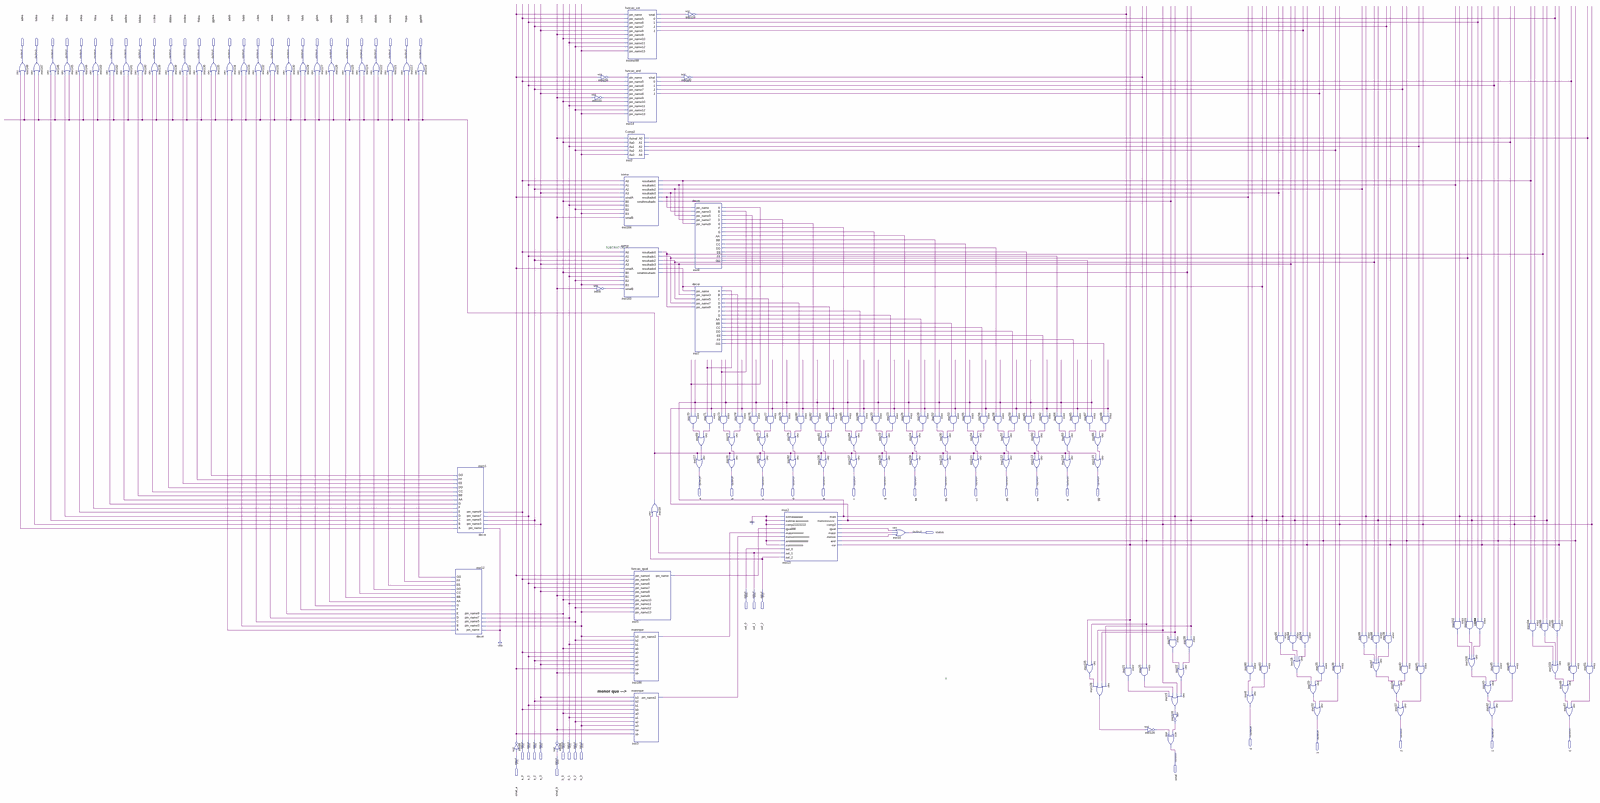
[diagram p0: schematic sheet, whole]
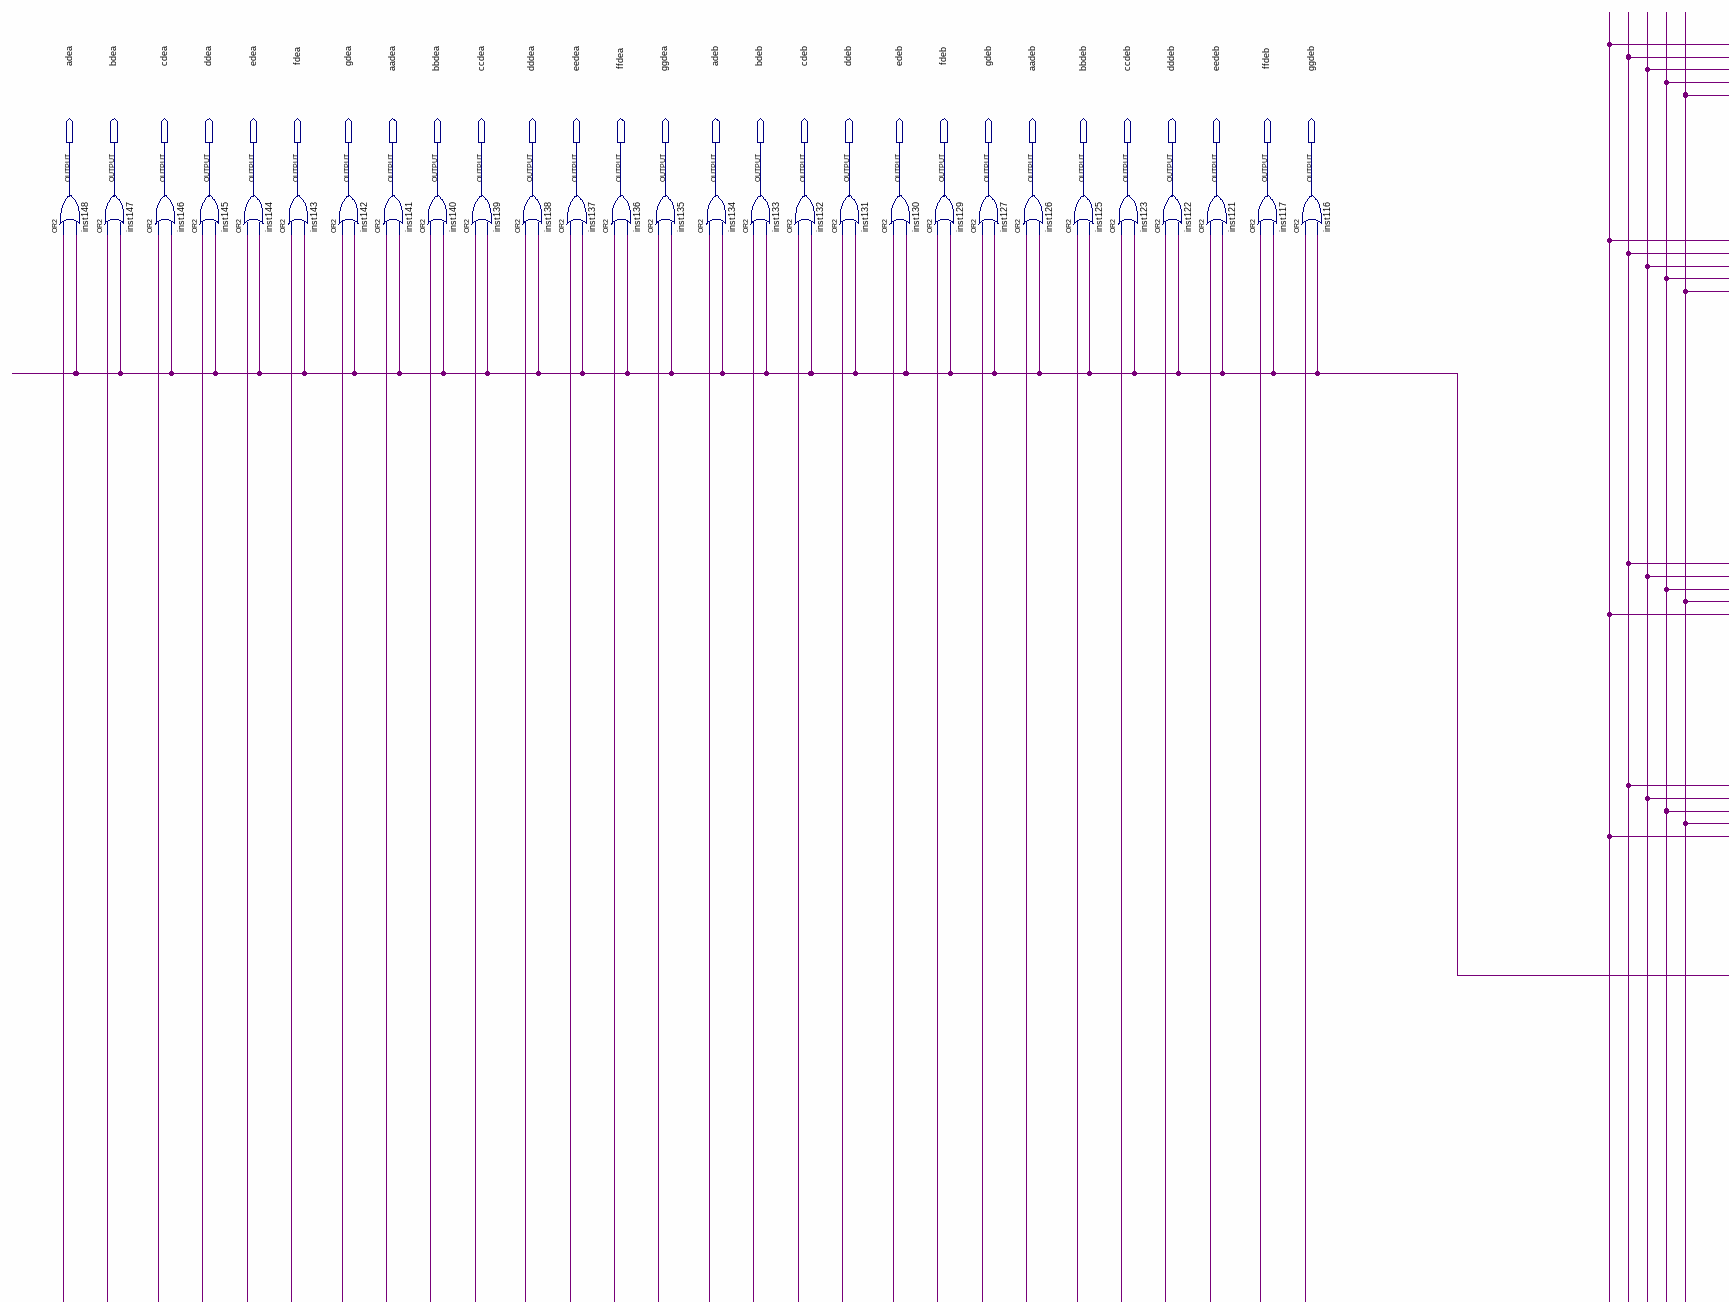
[diagram p1: schematic sheet, upper left part]
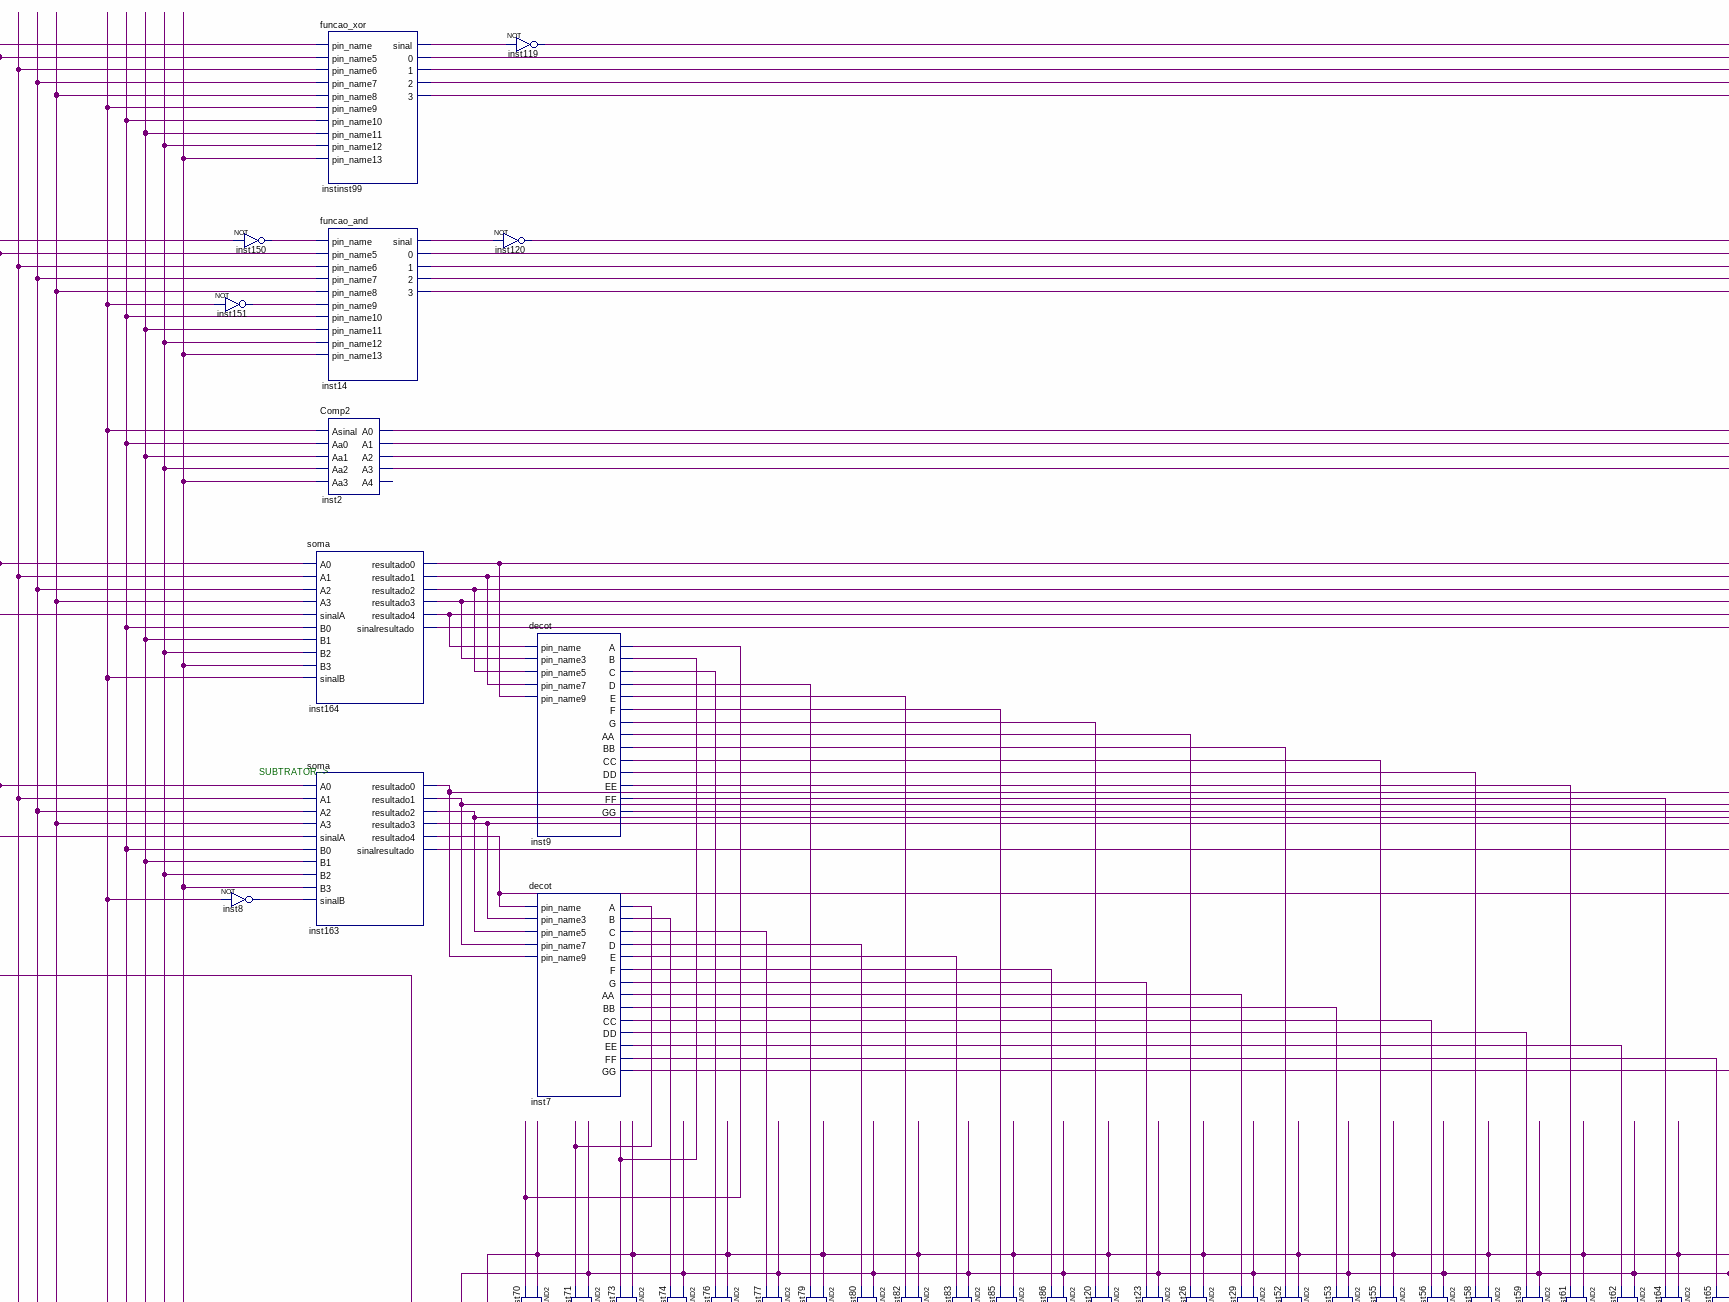
[diagram p2: schematic sheet, upper centre part]
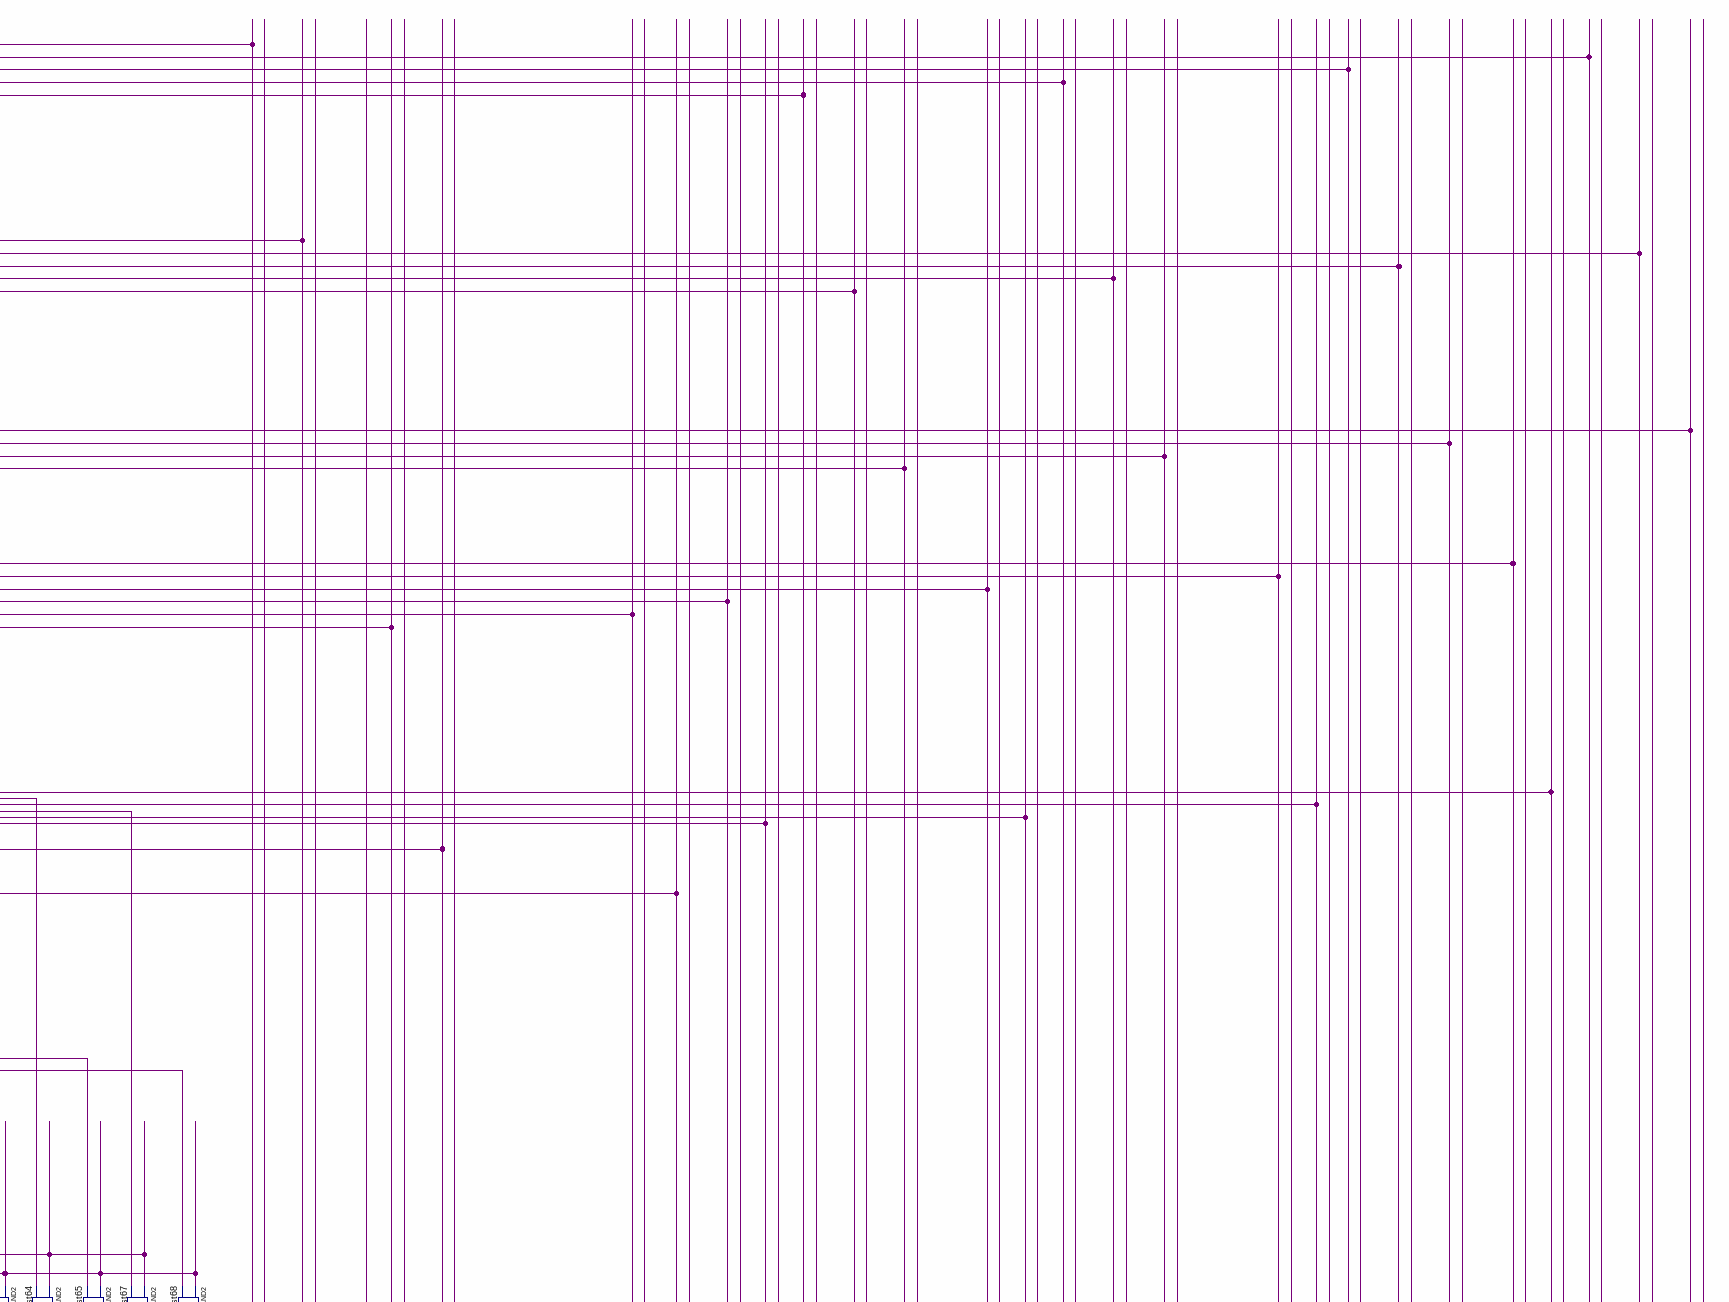
[diagram p3: schematic sheet, upper right part]
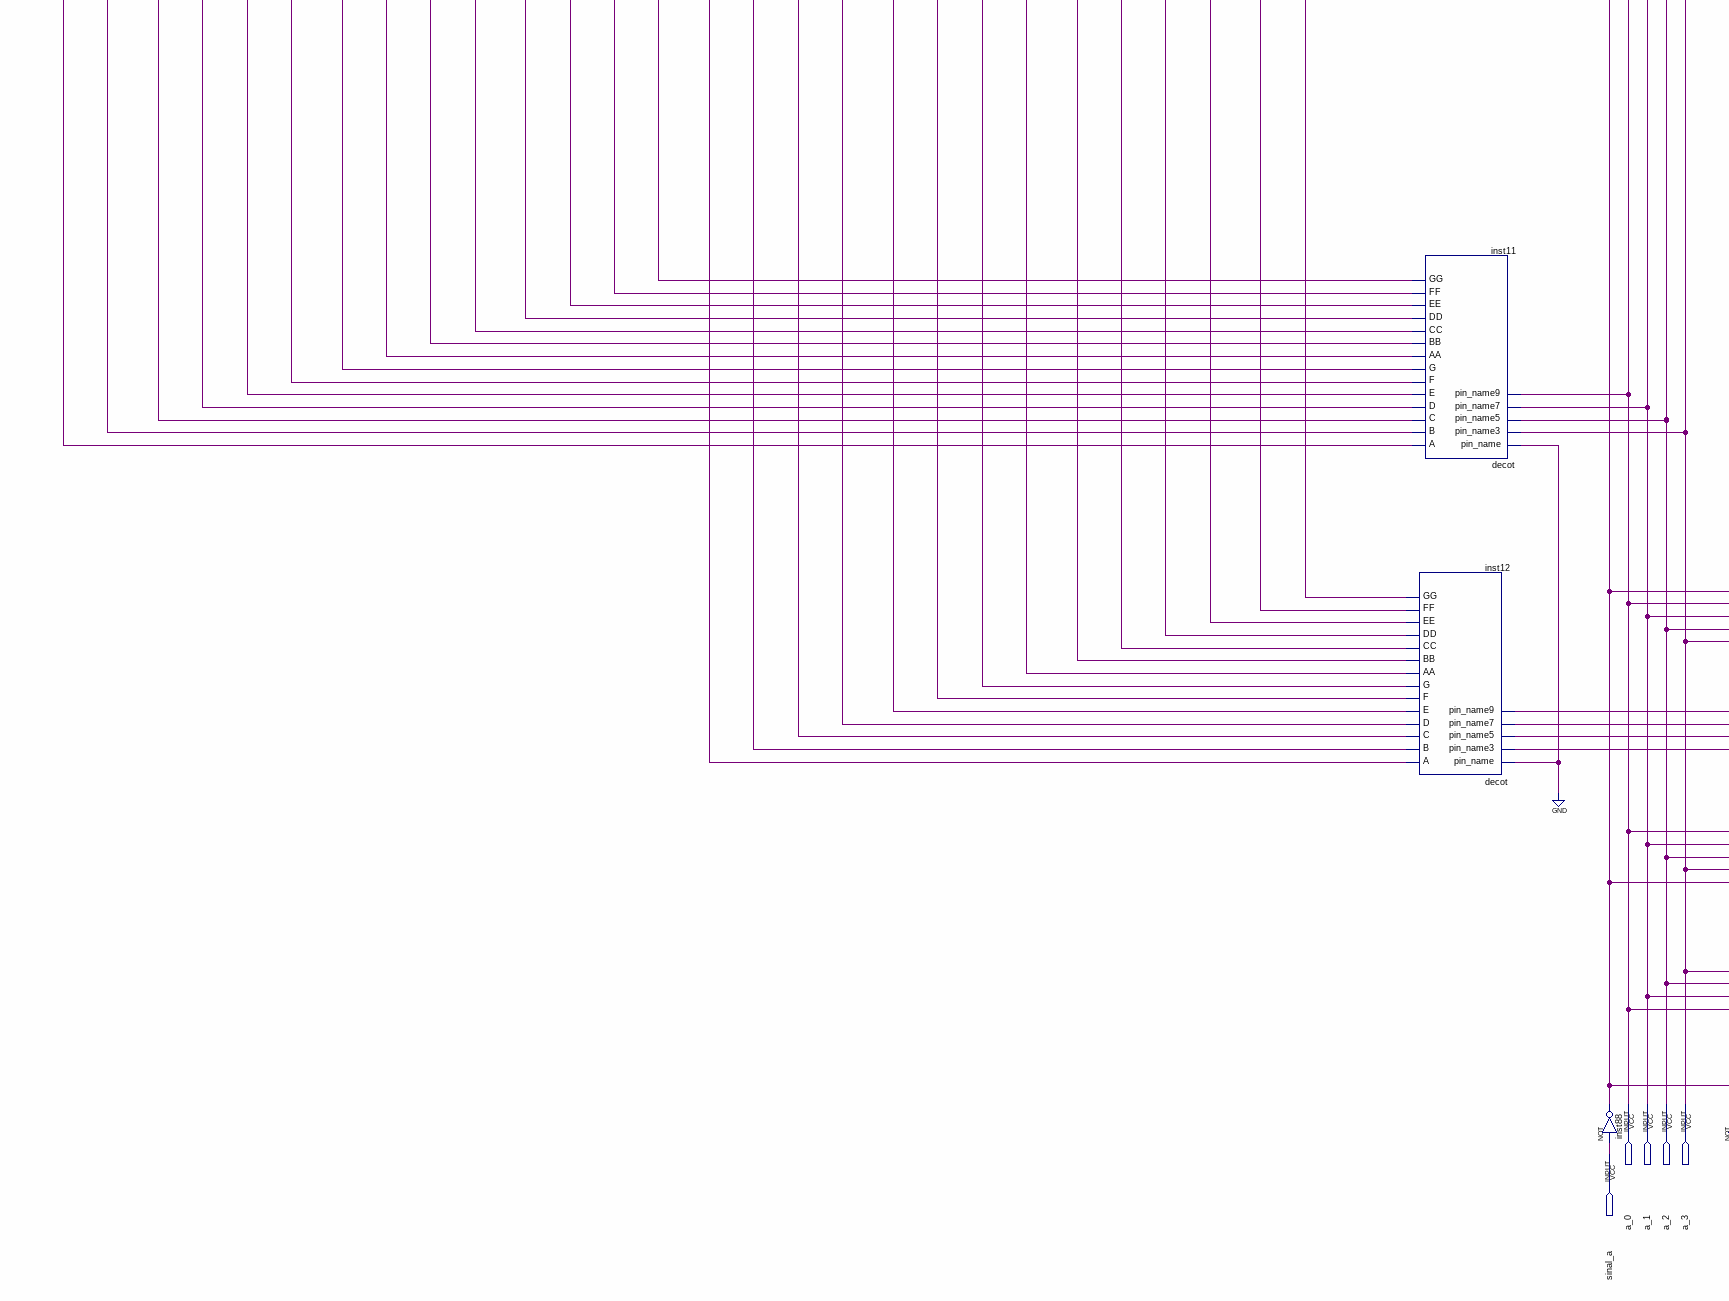
[diagram p4: schematic sheet, lower left part]
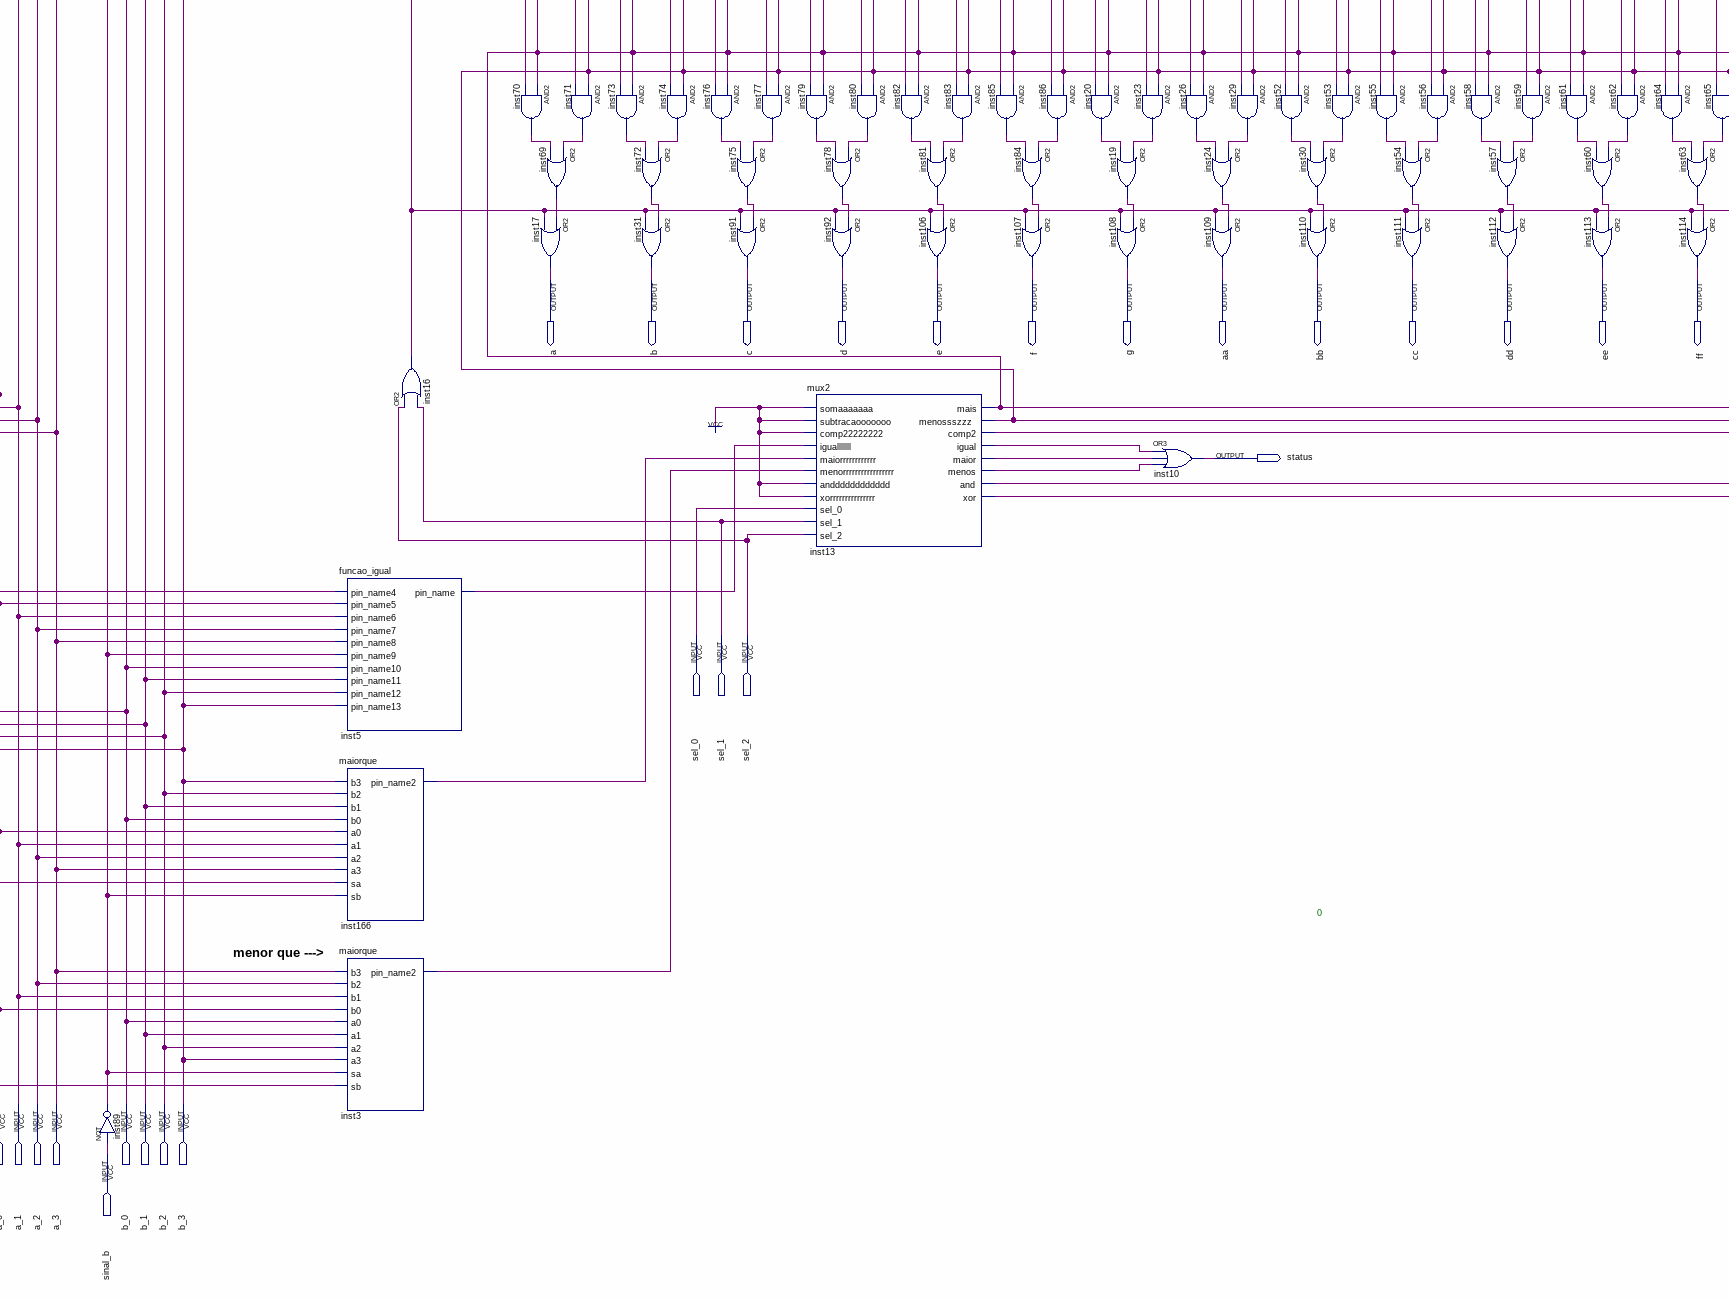
[diagram p5: schematic sheet, lower centre part]
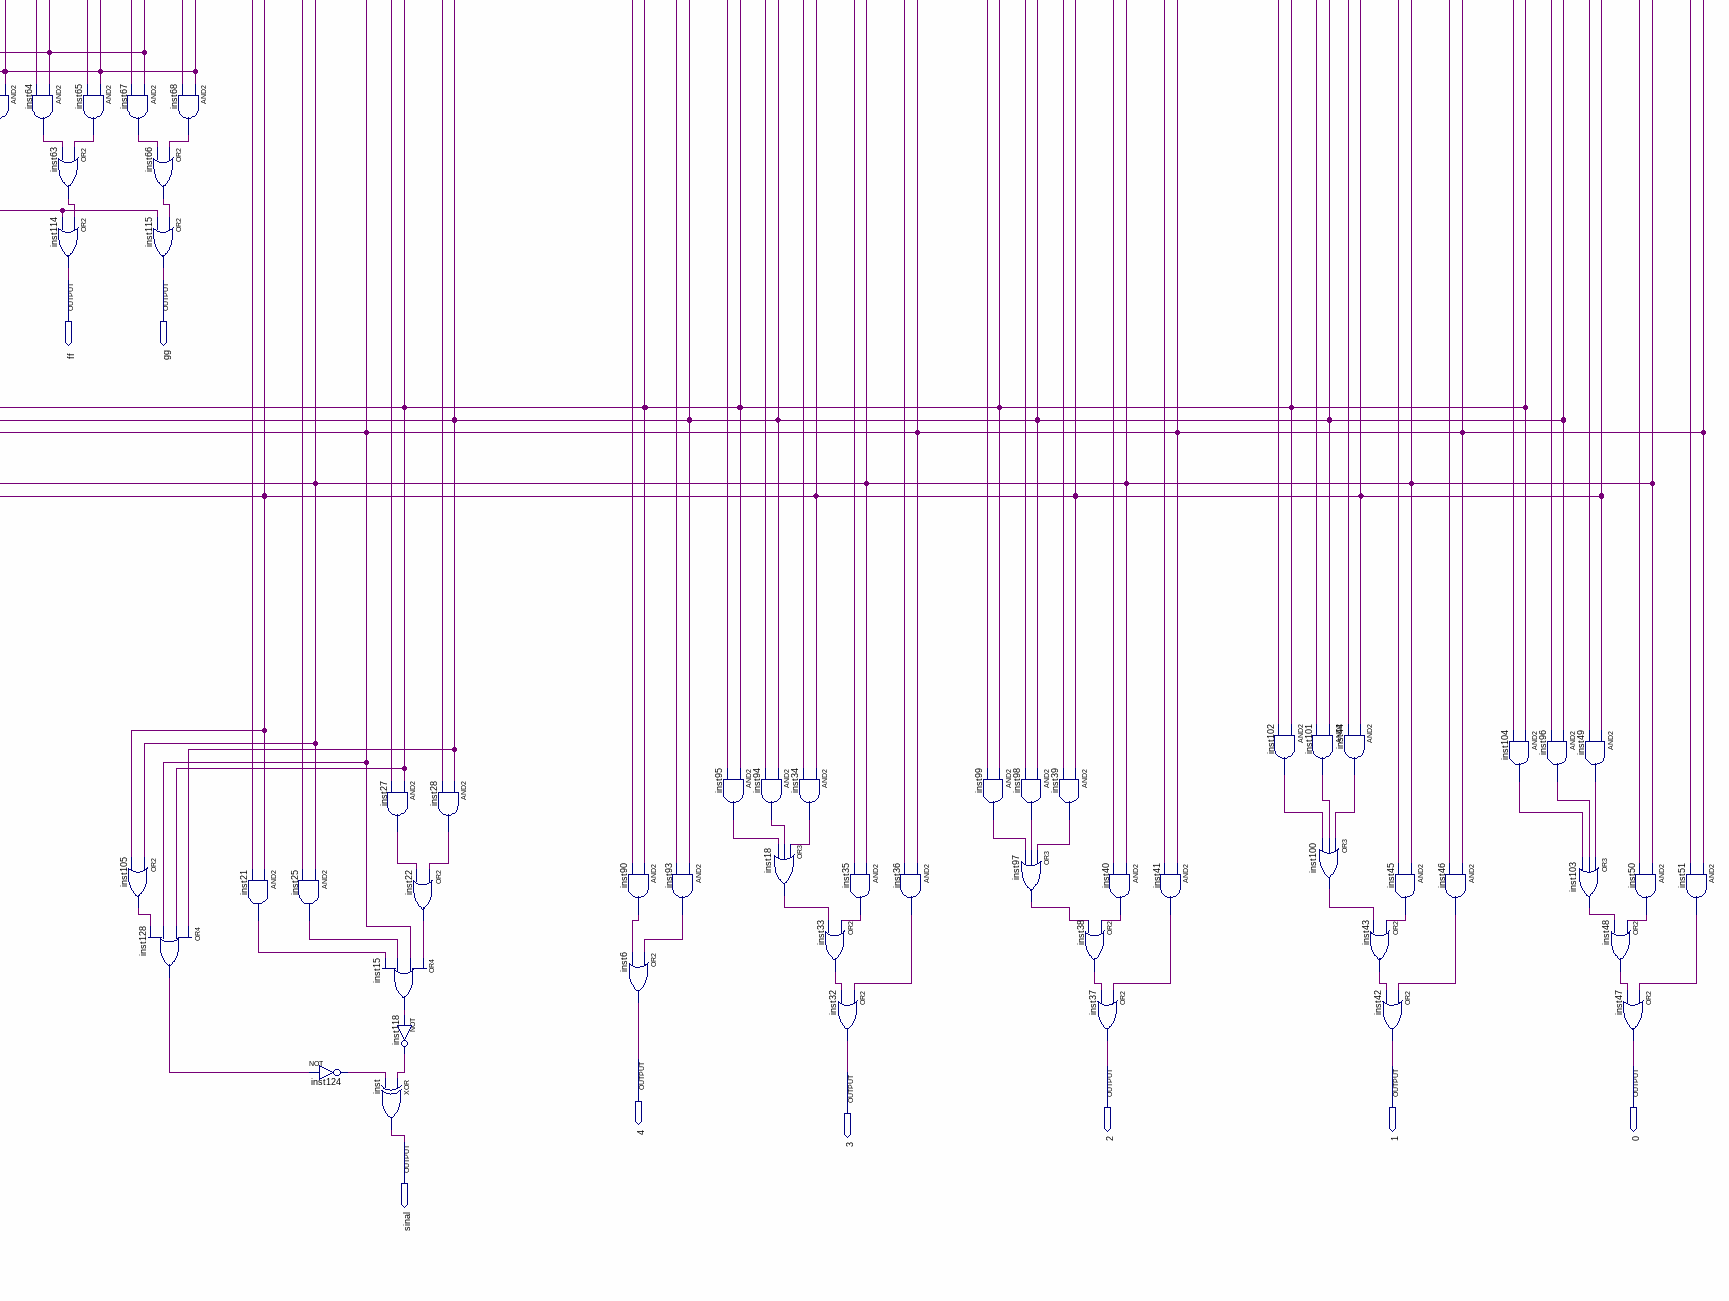
[diagram p6: schematic sheet, lower right part]
// Quartus schematic ula.bdf as structural Verilog: 152 symbols, 62 pins
module ula (
  input  sel_0,
  input  sel_1,
  input  sel_2,
  input  a_0,
  input  a_1,
  input  a_2,
  input  a_3,
  input  b_0,
  input  b_1,
  input  b_2,
  input  b_3,
  input  sinal_a,
  input  sinal_b,
  output adea,
  output bdea,
  output cdea,
  output ddea,
  output edea,
  output fdea,
  output gdea,
  output aadea,
  output bbdea,
  output ccdea,
  output dddea,
  output eedea,
  output ffdea,
  output ggdea,
  output adeb,
  output bdeb,
  output cdeb,
  output ddeb,
  output edeb,
  output fdeb,
  output gdeb,
  output aadeb,
  output bbdeb,
  output ccdeb,
  output dddeb,
  output eedeb,
  output ffdeb,
  output ggdeb,
  output a,
  output b,
  output c,
  output d,
  output e,
  output f,
  output g,
  output aa,
  output bb,
  output cc,
  output dd,
  output ee,
  output ff,
  output gg,
  output status,
  output \4 ,
  output \2 ,
  output \1 ,
  output \0 ,
  output \3 ,
  output sinal
);

  wire inst2_a0, inst2_a1, inst2_a2, inst2_a3, inst3_pin_name2, inst5_pin_name, inst7_a, inst7_aa, inst7_b,
       inst7_bb, inst7_c, inst7_cc, inst7_d, inst7_dd, inst7_e, inst7_ee, inst7_f, inst7_ff, inst7_g,
       inst7_gg, inst8_out, inst9_a, inst9_aa, inst9_b, inst9_bb, inst9_c, inst9_cc, inst9_d, inst9_dd,
       inst9_e, inst9_ee, inst9_f, inst9_ff, inst9_g, inst9_gg, inst11_a, inst11_aa, inst11_b, inst11_bb,
       inst11_c, inst11_cc, inst11_d, inst11_dd, inst11_e, inst11_ee, inst11_f, inst11_ff, inst11_g,
       inst11_gg, inst12_a, inst12_aa, inst12_b, inst12_bb, inst12_c, inst12_cc, inst12_d, inst12_dd,
       inst12_e, inst12_ee, inst12_f, inst12_ff, inst12_g, inst12_gg, inst13_and, inst13_comp2, inst13_igual,
       inst13_maior, inst13_mais, inst13_menos, inst13_menossszzz, inst13_xor, inst14_0, inst14_1, inst14_2,
       inst14_3, inst14_sinal, inst15_out, inst16_out, inst18_out, inst19_out, inst20_out, inst21_out,
       inst22_out, inst23_out, inst24_out, inst25_out, inst26_out, inst27_out, inst28_out, inst29_out,
       inst30_out, inst33_out, inst34_out, inst35_out, inst36_out, inst38_out, inst39_out, inst40_out,
       inst41_out, inst43_out, inst44_out, inst45_out, inst46_out, inst48_out, inst49_out, inst50_out,
       inst51_out, inst52_out, inst53_out, inst54_out, inst55_out, inst56_out, inst57_out, inst58_out,
       inst59_out, inst60_out, inst61_out, inst62_out, inst63_out, inst64_out, inst65_out, inst66_out,
       inst67_out, inst68_out, inst69_out, inst70_out, inst71_out, inst72_out, inst73_out, inst74_out,
       inst75_out, inst76_out, inst77_out, inst78_out, inst79_out, inst80_out, inst81_out, inst82_out,
       inst83_out, inst84_out, inst85_out, inst86_out, inst88_out, inst89_out, inst90_out, inst93_out,
       inst94_out, inst95_out, inst96_out, inst97_out, inst98_out, inst99_out, inst100_out, inst101_out,
       inst102_out, inst103_out, inst104_out, inst105_out, inst118_out, inst119_out, inst120_out,
       inst124_out, inst128_out, inst150_out, inst151_out, inst163_resultado0, inst163_resultado1,
       inst163_resultado2, inst163_resultado3, inst163_resultado4, inst163_sinalresultado,
       inst164_resultado0, inst164_resultado1, inst164_resultado2, inst164_resultado3, inst164_resultado4,
       inst164_sinalresultado, inst166_pin_name2, instinst99_0, instinst99_1, instinst99_2, instinst99_3,
       instinst99_sinal;

  or inst148 (adea, inst11_a, inst16_out);
  or inst147 (bdea, inst11_b, inst16_out);
  or inst146 (cdea, inst11_c, inst16_out);
  or inst145 (ddea, inst11_d, inst16_out);
  or inst144 (edea, inst11_e, inst16_out);
  or inst143 (fdea, inst11_f, inst16_out);
  or inst142 (gdea, inst11_g, inst16_out);
  or inst140 (bbdea, inst11_bb, inst16_out);
  or inst141 (aadea, inst11_aa, inst16_out);
  or inst139 (ccdea, inst11_cc, inst16_out);
  or inst138 (dddea, inst11_dd, inst16_out);
  or inst137 (eedea, inst11_ee, inst16_out);
  or inst136 (ffdea, inst11_ff, inst16_out);
  or inst135 (ggdea, inst11_gg, inst16_out);
  or inst134 (adeb, inst12_a, inst16_out);
  or inst133 (bdeb, inst12_b, inst16_out);
  or inst132 (cdeb, inst12_c, inst16_out);
  or inst131 (ddeb, inst12_d, inst16_out);
  or inst129 (fdeb, inst12_f, inst16_out);
  or inst130 (edeb, inst12_e, inst16_out);
  or inst127 (gdeb, inst12_g, inst16_out);
  or inst126 (aadeb, inst12_aa, inst16_out);
  or inst125 (bbdeb, inst12_bb, inst16_out);
  or inst123 (ccdeb, inst12_cc, inst16_out);
  or inst122 (dddeb, inst12_dd, inst16_out);
  or inst121 (eedeb, inst12_ee, inst16_out);
  or inst117 (ffdeb, inst12_ff, inst16_out);
  or inst116 (ggdeb, inst12_gg, inst16_out);
  decot inst11 (
    .pin_name(1'b0), .pin_name3(a_3), .pin_name5(a_2), .pin_name7(a_1), .pin_name9(a_0), .A(inst11_a),
    .B(inst11_b), .C(inst11_c), .D(inst11_d), .E(inst11_e), .F(inst11_f), .G(inst11_g), .AA(inst11_aa),
    .BB(inst11_bb), .CC(inst11_cc), .DD(inst11_dd), .EE(inst11_ee), .FF(inst11_ff), .GG(inst11_gg));
  decot inst12 (
    .pin_name(1'b0), .pin_name3(b_3), .pin_name5(b_2), .pin_name7(b_1), .pin_name9(b_0), .A(inst12_a),
    .B(inst12_b), .C(inst12_c), .D(inst12_d), .E(inst12_e), .F(inst12_f), .G(inst12_g), .AA(inst12_aa),
    .BB(inst12_bb), .CC(inst12_cc), .DD(inst12_dd), .EE(inst12_ee), .FF(inst12_ff), .GG(inst12_gg));
  not inst88 (inst88_out, sinal_a);
  not inst89 (inst89_out, sinal_b);
  not inst150 (inst150_out, inst88_out);
  not inst151 (inst151_out, inst89_out);
  not inst8 (inst8_out, inst89_out);
  soma inst164 (
    .A0(a_0), .A1(a_1), .A2(a_2), .A3(a_3), .sinalA(inst88_out), .B0(b_0), .B1(b_1), .B2(b_2), .B3(b_3),
    .sinalB(inst89_out), .resultado0(inst164_resultado0), .resultado1(inst164_resultado1),
    .resultado2(inst164_resultado2), .resultado3(inst164_resultado3), .resultado4(inst164_resultado4),
    .sinalresultado(inst164_sinalresultado));
  soma inst163 (
    .A0(a_0), .A1(a_1), .A2(a_2), .A3(a_3), .sinalA(inst88_out), .B0(b_0), .B1(b_1), .B2(b_2), .B3(b_3),
    .sinalB(inst8_out), .resultado0(inst163_resultado0), .resultado1(inst163_resultado1),
    .resultado2(inst163_resultado2), .resultado3(inst163_resultado3), .resultado4(inst163_resultado4),
    .sinalresultado(inst163_sinalresultado));
  funcao_xor instinst99 (
    .pin_name(inst88_out), .pin_name5(a_0), .pin_name6(a_1), .pin_name7(a_2), .pin_name8(a_3),
    .pin_name9(inst89_out), .pin_name10(b_0), .pin_name11(b_1), .pin_name12(b_2), .pin_name13(b_3),
    .sinal(instinst99_sinal), .\0 (instinst99_0), .\1 (instinst99_1), .\2 (instinst99_2), .\3 (instinst99_3));
  funcao_and inst14 (
    .pin_name(inst150_out), .pin_name5(a_0), .pin_name6(a_1), .pin_name7(a_2), .pin_name8(a_3),
    .pin_name9(inst151_out), .pin_name10(b_0), .pin_name11(b_1), .pin_name12(b_2), .pin_name13(b_3),
    .sinal(inst14_sinal), .\0 (inst14_0), .\1 (inst14_1), .\2 (inst14_2), .\3 (inst14_3));
  Comp2 inst2 (
    .Asinal(inst89_out), .Aa0(b_0), .Aa1(b_1), .Aa2(b_2), .Aa3(b_3), .A0(inst2_a0), .A1(inst2_a1),
    .A2(inst2_a2), .A3(inst2_a3));  // open: A4
  funcao_igual inst5 (
    .pin_name4(inst88_out), .pin_name5(a_0), .pin_name6(a_1), .pin_name7(a_2), .pin_name8(a_3),
    .pin_name9(inst89_out), .pin_name10(b_0), .pin_name11(b_1), .pin_name12(b_2), .pin_name13(b_3),
    .pin_name(inst5_pin_name));
  maiorque inst166 (
    .b3(b_3), .b2(b_2), .b1(b_1), .b0(b_0), .a0(a_0), .a1(a_1), .a2(a_2), .a3(a_3), .sa(inst88_out),
    .sb(inst89_out), .pin_name2(inst166_pin_name2));
  maiorque inst3 (
    .b3(a_3), .b2(a_2), .b1(a_1), .b0(a_0), .a0(b_0), .a1(b_1), .a2(b_2), .a3(b_3), .sa(inst89_out),
    .sb(inst88_out), .pin_name2(inst3_pin_name2));
  or inst16 (inst16_out, sel_2, sel_1);
  not inst119 (inst119_out, instinst99_sinal);
  not inst120 (inst120_out, inst14_sinal);
  and inst70 (inst70_out, inst13_mais, inst9_a);
  decot inst9 (
    .pin_name(inst164_resultado4), .pin_name3(inst164_resultado3), .pin_name5(inst164_resultado2),
    .pin_name7(inst164_resultado1), .pin_name9(inst164_resultado0), .A(inst9_a), .B(inst9_b), .C(inst9_c),
    .D(inst9_d), .E(inst9_e), .F(inst9_f), .G(inst9_g), .AA(inst9_aa), .BB(inst9_bb), .CC(inst9_cc),
    .DD(inst9_dd), .EE(inst9_ee), .FF(inst9_ff), .GG(inst9_gg));
  decot inst7 (
    .pin_name(inst163_resultado4), .pin_name3(inst163_resultado3), .pin_name5(inst163_resultado2),
    .pin_name7(inst163_resultado1), .pin_name9(inst163_resultado0), .A(inst7_a), .B(inst7_b), .C(inst7_c),
    .D(inst7_d), .E(inst7_e), .F(inst7_f), .G(inst7_g), .AA(inst7_aa), .BB(inst7_bb), .CC(inst7_cc),
    .DD(inst7_dd), .EE(inst7_ee), .FF(inst7_ff), .GG(inst7_gg));
  and inst71 (inst71_out, inst13_menossszzz, inst7_a);
  or inst69 (inst69_out, inst71_out, inst70_out);
  or inst17 (a, inst69_out, inst16_out);
  and inst73 (inst73_out, inst13_mais, inst9_b);
  and inst74 (inst74_out, inst13_menossszzz, inst7_b);
  or inst72 (inst72_out, inst74_out, inst73_out);
  or inst31 (b, inst72_out, inst16_out);
  and inst76 (inst76_out, inst13_mais, inst9_c);
  and inst77 (inst77_out, inst13_menossszzz, inst7_c);
  or inst75 (inst75_out, inst77_out, inst76_out);
  or inst91 (c, inst75_out, inst16_out);
  and inst79 (inst79_out, inst13_mais, inst9_d);
  mux2 inst13 (
    .somaaaaaaa(1'b1), .subtracaooooooo(1'b1), .comp22222222(1'b1), .igualllllll(inst5_pin_name),
    .maiorrrrrrrrrrrr(inst166_pin_name2), .menorrrrrrrrrrrrrrrrr(inst3_pin_name2), .andddddddddddd(1'b1),
    .xorrrrrrrrrrrrrrr(1'b1), .sel_0(sel_0), .sel_1(sel_1), .sel_2(sel_2), .mais(inst13_mais),
    .menossszzz(inst13_menossszzz), .comp2(inst13_comp2), .igual(inst13_igual), .maior(inst13_maior),
    .menos(inst13_menos), .\and (inst13_and), .\xor (inst13_xor));
  and inst80 (inst80_out, inst13_menossszzz, inst7_d);
  or inst78 (inst78_out, inst80_out, inst79_out);
  or inst92 (d, inst78_out, inst16_out);
  and inst82 (inst82_out, inst13_mais, inst9_e);
  or inst81 (inst81_out, inst83_out, inst82_out);
  or inst106 (e, inst81_out, inst16_out);
  and inst83 (inst83_out, inst13_menossszzz, inst7_e);
  and inst85 (inst85_out, inst13_mais, inst9_f);
  or inst84 (inst84_out, inst86_out, inst85_out);
  or inst107 (f, inst84_out, inst16_out);
  and inst86 (inst86_out, inst13_menossszzz, inst7_f);
  and inst20 (inst20_out, inst13_mais, inst9_g);
  or inst19 (inst19_out, inst23_out, inst20_out);
  or inst108 (g, inst19_out, inst16_out);
  and inst23 (inst23_out, inst13_menossszzz, inst7_g);
  or inst10 (status, inst13_igual, inst13_maior, inst13_menos);
  and inst26 (inst26_out, inst13_mais, inst9_aa);
  or inst24 (inst24_out, inst29_out, inst26_out);
  or inst109 (aa, inst24_out, inst16_out);
  and inst29 (inst29_out, inst13_menossszzz, inst7_aa);
  and inst52 (inst52_out, inst13_mais, inst9_bb);
  and inst53 (inst53_out, inst13_menossszzz, inst7_bb);
  or inst30 (inst30_out, inst53_out, inst52_out);
  or inst110 (bb, inst30_out, inst16_out);
  and inst55 (inst55_out, inst13_mais, inst9_cc);
  and inst56 (inst56_out, inst13_menossszzz, inst7_cc);
  or inst54 (inst54_out, inst56_out, inst55_out);
  or inst111 (cc, inst54_out, inst16_out);
  and inst58 (inst58_out, inst13_mais, inst9_dd);
  and inst59 (inst59_out, inst13_menossszzz, inst7_dd);
  or inst57 (inst57_out, inst59_out, inst58_out);
  or inst112 (dd, inst57_out, inst16_out);
  and inst61 (inst61_out, inst13_mais, inst9_ee);
  and inst62 (inst62_out, inst13_menossszzz, inst7_ee);
  or inst60 (inst60_out, inst62_out, inst61_out);
  or inst113 (ee, inst60_out, inst16_out);
  and inst64 (inst64_out, inst13_mais, inst9_ff);
  or inst63 (inst63_out, inst65_out, inst64_out);
  or inst114 (ff, inst63_out, inst16_out);
  and inst65 (inst65_out, inst13_menossszzz, inst7_ff);
  and inst67 (inst67_out, inst13_mais, inst9_gg);
  or inst66 (inst66_out, inst68_out, inst67_out);
  or inst115 (gg, inst66_out, inst16_out);
  or inst105 (inst105_out, inst13_and, inst13_xor);
  or inst128 (inst128_out, inst13_menossszzz, inst13_mais, inst13_comp2, inst105_out);
  and inst68 (inst68_out, inst13_menossszzz, inst7_gg);
  and inst21 (inst21_out, inst13_xor, inst119_out);
  and inst25 (inst25_out, inst13_and, inst120_out);
  not inst124 (inst124_out, inst128_out);
  and inst27 (inst27_out, inst13_mais, inst164_sinalresultado);
  or inst22 (inst22_out, inst28_out, inst27_out);
  or inst15 (inst15_out, inst22_out, inst13_comp2, inst25_out, inst21_out);
  not inst118 (inst118_out, inst15_out);
  xor inst (sinal, inst118_out, inst124_out);
  and inst28 (inst28_out, inst13_menossszzz, inst163_sinalresultado);
  and inst90 (inst90_out, inst13_mais, inst164_resultado4);
  or inst6 (\4 , inst93_out, inst90_out);
  and inst93 (inst93_out, inst13_menossszzz, inst163_resultado4);
  and inst94 (inst94_out, inst13_menossszzz, inst163_resultado3);
  and inst95 (inst95_out, inst13_mais, inst164_resultado3);
  and inst34 (inst34_out, inst13_xor, instinst99_3);
  or inst18 (inst18_out, inst34_out, inst94_out, inst95_out);
  and inst35 (inst35_out, inst13_and, inst14_3);
  or inst33 (inst33_out, inst35_out, inst18_out);
  or inst32 (\3 , inst36_out, inst33_out);
  and inst36 (inst36_out, inst13_comp2, inst2_a3);
  and inst98 (inst98_out, inst13_menossszzz, inst163_resultado2);
  and inst99 (inst99_out, inst13_mais, inst164_resultado2);
  or inst97 (inst97_out, inst39_out, inst98_out, inst99_out);
  and inst39 (inst39_out, inst13_xor, instinst99_2);
  and inst40 (inst40_out, inst13_and, inst14_2);
  or inst38 (inst38_out, inst40_out, inst97_out);
  or inst37 (\2 , inst41_out, inst38_out);
  and inst41 (inst41_out, inst13_comp2, inst2_a2);
  and inst102 (inst102_out, inst13_mais, inst164_resultado1);
  and inst101 (inst101_out, inst13_menossszzz, inst163_resultado1);
  or inst100 (inst100_out, inst44_out, inst101_out, inst102_out);
  and inst44 (inst44_out, inst13_xor, instinst99_1);
  or inst43 (inst43_out, inst45_out, inst100_out);
  and inst45 (inst45_out, inst13_and, inst14_1);
  or inst42 (\1 , inst46_out, inst43_out);
  and inst46 (inst46_out, inst13_comp2, inst2_a1);
  and inst104 (inst104_out, inst13_mais, inst164_resultado0);
  and inst96 (inst96_out, inst13_menossszzz, inst163_resultado0);
  or inst103 (inst103_out, inst49_out, inst96_out, inst104_out);
  and inst49 (inst49_out, inst13_xor, instinst99_0);
  or inst48 (inst48_out, inst50_out, inst103_out);
  or inst47 (\0 , inst51_out, inst48_out);
  and inst50 (inst50_out, inst13_and, inst14_0);
  and inst51 (inst51_out, inst13_comp2, inst2_a0);

  // Notes on the sheet:
  //   SUBTRATOR-->
  //   0
  //   menor que --->
endmodule
